# EAGLE design pirFadeDC (EAGLE 7.7.0)
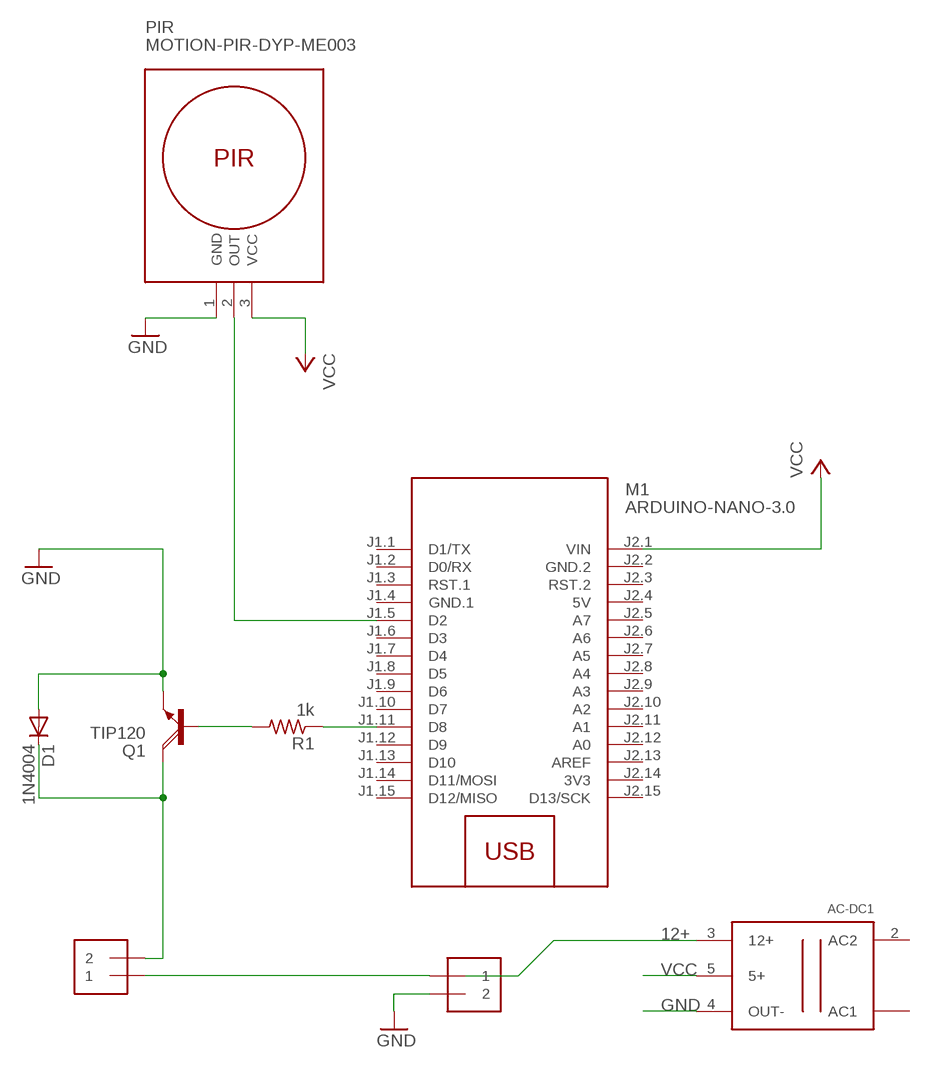
[diagram p0: schematic, sheet 1]

## Parts
AC-DC1  GENERIC_AC/DC  [AC/DC]
D1  1N4004  [DO41-10]
J1  1X2-3.5MM  [1X2-3.5MM]
J2  1X2-3.5MM  [1X2-3.5MM]
M1  ARDUINO-NANO-3.0  [ARDUINO-NANO-3.0]
PIR  MOTION-PIR-DYP-ME003  [MOTION-PIR-DYP-ME003]
Q1  TIP120  [TO220AH]
R1  1k  FLIPFLOP-RES  [0805-THM]

## Nets
12+: AC-DC1.3(12+)
GND: AC-DC1.4(OUT-) D1.A J2.2 PIR.1(GND) Q1.E
N$1: M1.J1.11(D8) R1.1
N$2: Q1.B R1.2
N$3: J1.1 J2.1
N$4: M1.J1.5(D2) PIR.2(OUT)
N$5: D1.C J1.2 Q1.C
VCC: AC-DC1.5(5+) M1.J2.1(VIN) PIR.3(VCC)
Unconnected: AC-DC1.1(AC1) AC-DC1.2(AC2) M1.J1.1(D1/TX) M1.J1.2(D0/RX) M1.J1.3(RST.1) M1.J1.6(D3) M1.J1.7(D4) M1.J1.8(D5) M1.J1.9(D6) M1.J1.10(D7) M1.J1.12(D9) M1.J1.13(D10) M1.J1.14(D11/MOSI) M1.J1.15(D12/MISO) M1.J2.3(RST.2) M1.J2.5(A7) M1.J2.6(A6) M1.J2.7(A5) M1.J2.8(A4) M1.J2.9(A3) M1.J2.10(A2) M1.J2.11(A1) M1.J2.12(A0) M1.J2.13(AREF) M1.J2.15(D13/SCK)

## Power pins joined to a net without a drawn wire
3V3: M1.J2.14(3V3)
5V: M1.J2.4(5V)
GND.1: M1.J1.4(GND.1)
GND.2: M1.J2.2(GND.2)

## Library data of the parts
AC-DC1 = mySymb:GENERIC_AC/DC
D1 = adafruit:1N4004: DIODE General purpose 1N400x type rectifier (With bigger pads) http://www.ladyada.net/library/pcb/eaglelibrary.html
J1 J2 = adafruit:1X2: 3.5mm Terminal block http://www.ladyada.net/library/pcb/eaglelibrary.html
M1 = diy-modules:ARDUINO-NANO-3.0: Arduino Nano 3.0
PIR = diy-modules:MOTION-PIR-DYP-ME003: PIR Motion Sensor Module DYP-ME003 based on BISS0001 pyroelectic detector
Q1 = transistor-power:TIP120: NPN DARLINGTON TRANSISTOR
R1 = adafruit:FLIPFLOP-RES: Flip Flop resistor An 0805 resistor inside a standard 1/4W 5% resistor. Makes for easy mods

## Net classes
0 default: width 0.305 mm, drill 0.508 mm, clearance 0.254 mm

## Board
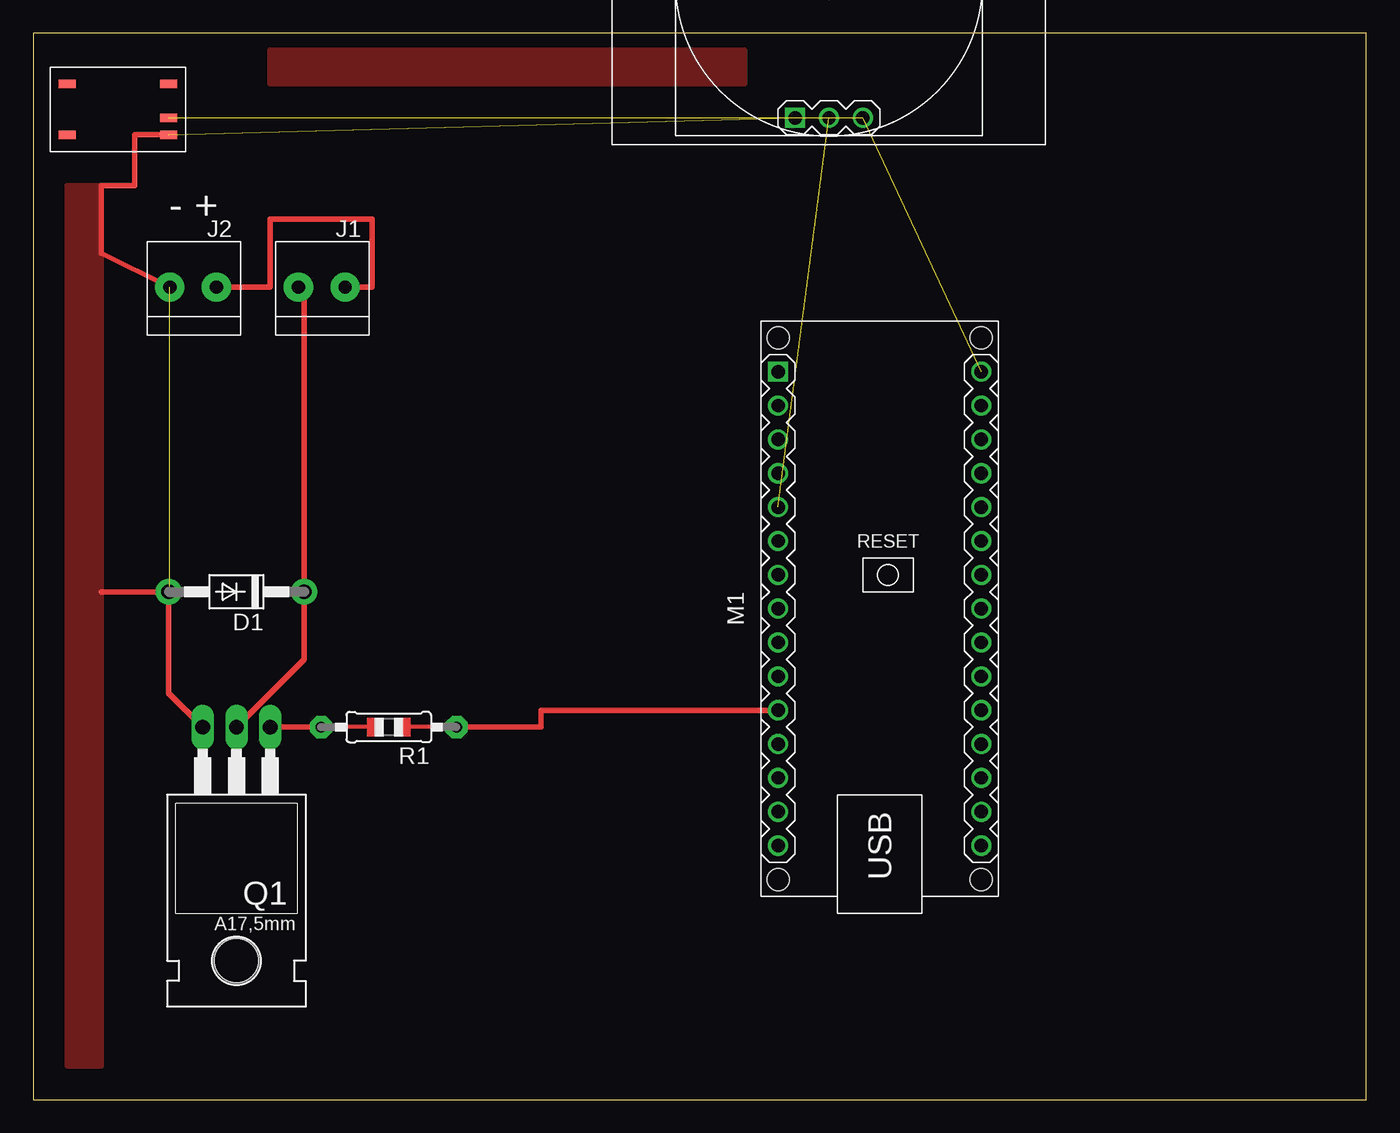
[diagram p1: board, top side]

Size 100 x 80 mm. Coordinates in mm from the lower left corner, seen from the top.
Outline: 0,0 100,0 100,80 0,80 0,0
Copper layers (1*16): Top 0.035mm / dielectric 1.5mm / Bottom 0.035mm
Design rules "default": minimum track width 10mil, minimum drill 24mil, track to track 8mil, track to pad 8mil, pad to pad 8mil, via to via 8mil, smd to smd 8mil, copper to edge 40mil, drill to drill 8mil, minimum pad ring 10mil, minimum via ring 8mil, stop-mask expansion 4mil, vias tented up to drill 0mil, thermal gap 10mil

### Footprints (pad centres in the part's own frame; a part is rotated, then mirrored left to right if it is on the bottom)
AC/DC = smd 1.27 x 0.635: 1 0,3.81; 2 0,0; 3 7.62,3.81; 4 7.62,0; 5 7.62,1.27
DO41-10 = drill 1.118 pad 1.93: A 5.08,0; C -5.08,0
1X2-3.5MM = drill 1 pad 2.184: 1 1.8,0; 2 -1.7,0
ARDUINO-NANO-3.0 = drill 1 square: J1.1 17.78,7.62 | drill 1: J1.2 15.24,7.62; J1.3 12.7,7.62; J1.4 10.16,7.62; J1.5 7.62,7.62; J1.6 5.08,7.62; J1.7 2.54,7.62; J1.8 0,7.62; J1.9 -2.54,7.62; J1.10 -5.08,7.62; J1.11 -7.62,7.62; J1.12 -10.16,7.62; J1.13 -12.7,7.62; J1.14 -15.24,7.62; J1.15 -17.78,7.62; J2.1 17.78,-7.62; J2.2 15.24,-7.62; J2.3 12.7,-7.62; J2.4 10.16,-7.62; J2.5 7.62,-7.62; J2.6 5.08,-7.62; J2.7 2.54,-7.62; J2.8 0,-7.62; J2.9 -2.54,-7.62; J2.10 -5.08,-7.62; J2.11 -7.62,-7.62; J2.12 -10.16,-7.62; J2.13 -12.7,-7.62; J2.14 -15.24,-7.62; J2.15 -17.78,-7.62 | hole 1.651: -20.32,7.62; -20.32,-7.62; 20.32,-7.62; 20.32,7.62
MOTION-PIR-DYP-ME003 = drill 1 square: 1 -2.54,-10.16 | drill 1: 2 0,-10.16; 3 2.54,-10.16 | hole 1.8: -14.1,0; 14.1,0
TO220AH = drill 1.118 long: B -2.54,-6.35; C 0,-6.35; E 2.54,-6.35 | hole 3.302: 0,11.176
0805-THM = drill 0.813 pad 1.676 octagon: 1 -5.08,0; 2 5.08,0

### Placement (x,y rotation side)
AC-DC1  2.54,72.39 0 top
D1  15.24,38.1 180 top
J1  21.59,60.96 0 top
J2  11.94,60.96 0 top
M1  63.5,36.83 90 top
PIR  59.69,83.82 0 top
Q1  15.24,21.59 180 top
R1  26.67,27.94 180 top

### Tracks (layer width: path | path; a pad name or v marks a point on that pad's centre or on a via)
GND  (2 unrouted)
  Top 0.406: AC-DC1.4 7.62,72.39 7.62,68.58 5.08,68.58 5.08,63.5 J2.2 | Q1.E 10.16,30.48 D1.A | D1.A 10.24,38.18 | D1.A 5.08,38.1
  pour Top: 2.54,68.58 2.54,2.54 5.08,2.54 5.08,68.58
  pour Top: 20.32,78.74 53.34,78.74 53.34,76.2 17.78,76.2 17.78,78.74
N$1
  Top 0.406: M1.J1.11 38.1,29.21 38.1,27.94 R1.1
N$2
  Top 0.406: R1.2 Q1.B
N$3
  Top 0.406: J2.1 17.78,60.96 17.78,66.04 25.4,66.04 25.4,60.96 J1.1
N$4  (1 unrouted)
N$5
  Top 0.406: Q1.C 20.32,33.02 D1.C 20.32,60.96 J1.2
VCC  (2 unrouted)

### Text on the board
tPlace: - +